# Altium schematic sheet Interface2.SchDoc
size A4
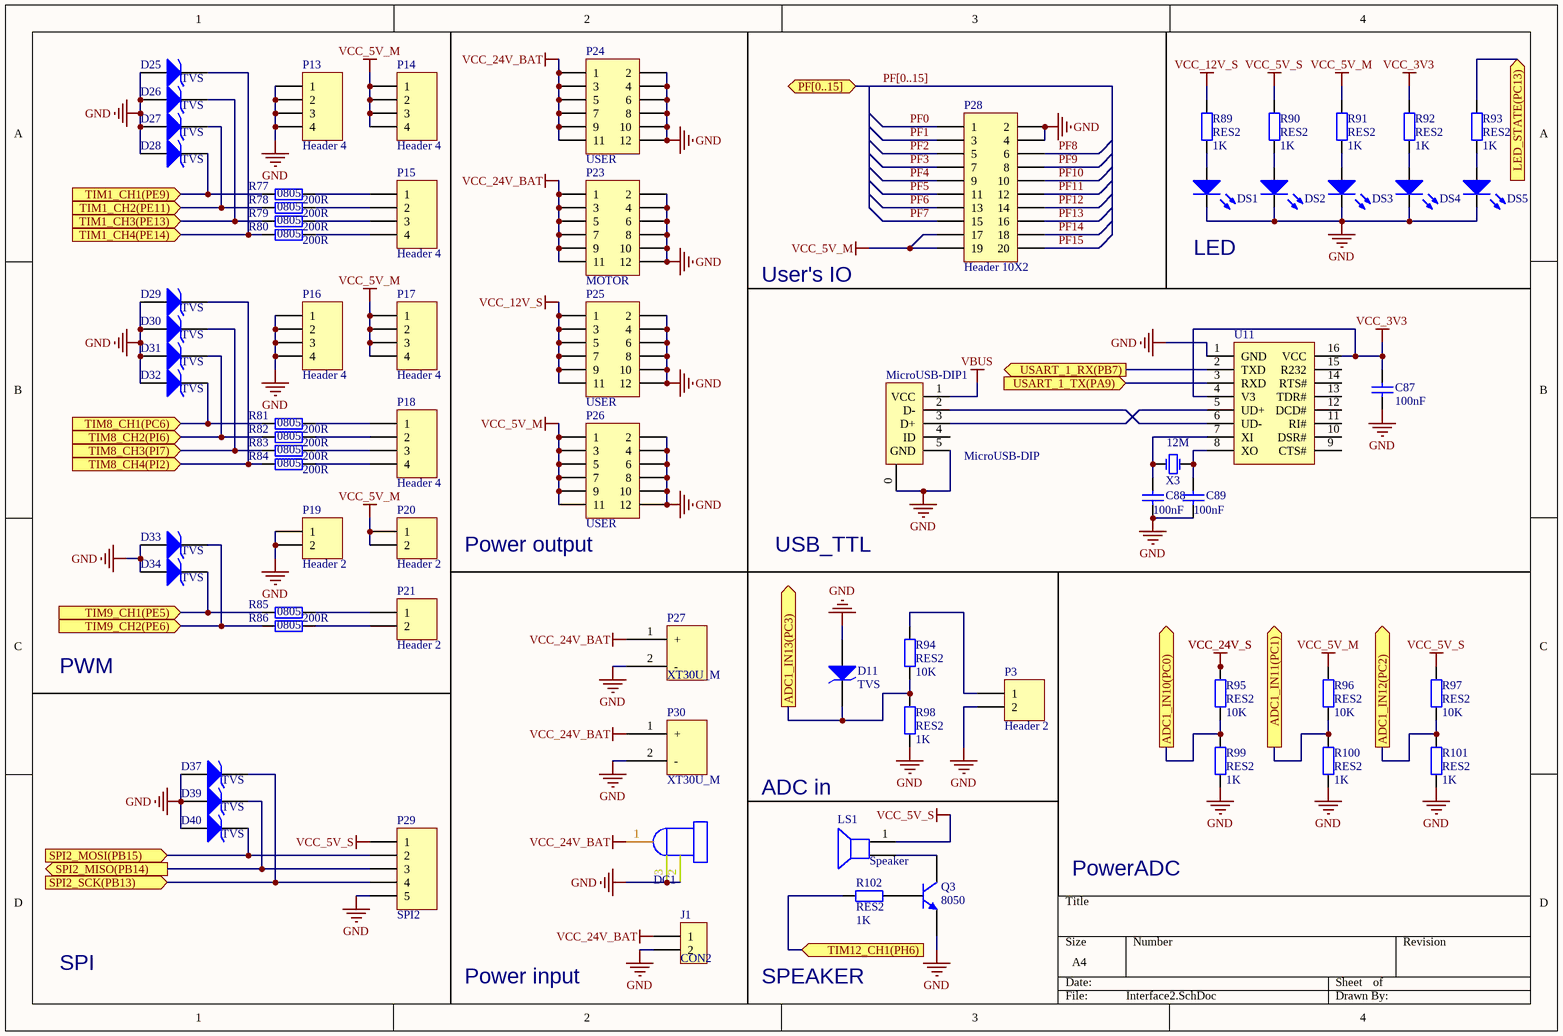
[diagram p0: Interface2.SchDoc]

## Parts
C87  value 100nF  [C 0805_L]  (hidden comment: CAP)
C88  value 100nF  [C 0805_L]  (hidden comment: CAP)
C89  value 100nF  [C 0805_L]  (hidden comment: CAP)
D11  TVS  [SOD-523]
D25  TVS  [SOD-523]
D26  TVS  [SOD-523]
D27  TVS  [SOD-523]
D28  TVS  [SOD-523]
D29  TVS  [SOD-523]
D30  TVS  [SOD-523]
D31  TVS  [SOD-523]
D32  TVS  [SOD-523]
D33  TVS  [SOD-523]
D34  TVS  [SOD-523]
D37  TVS  [SOD-523]
D39  TVS  [SOD-523]
D40  TVS  [SOD-523]
DC1  DC  [DC-005]  (value not drawn)
DS1  LED  [LED 0805B]  (value not drawn)
DS2  LED  [LED 0805B]  (value not drawn)
DS3  LED  [LED 0805B]  (value not drawn)
DS4  LED  [LED 0805B]  (value not drawn)
DS5  LED  [LED 0805B]  (value not drawn)
J1  CON2  [DG1282-5.0]
LS1  Speaker  [BEEP 5x9x5.5]
MicroUSB-DIP1  MicroUSB-DIP  [MICRO_USB_DIP]
P3  Header 2  [HDR2.54-LI-2P]
P13  Header 4  [HDR2.54-LI-4P]
P14  Header 4  [HDR2.54-LI-4P]
P15  Header 4  [HDR2.54-LI-4P]
P16  Header 4  [HDR2.54-LI-4P]
P17  Header 4  [HDR2.54-LI-4P]
P18  Header 4  [HDR2.54-LI-4P]
P19  Header 2  [HDR2.54-LI-2P]
P20  Header 2  [HDR2.54-LI-2P]
P21  Header 2  [HDR2.54-LI-2P]
P23  MOTOR  [HDR2.54-LI-2x6P]
P24  USER  [HDR2.54-LI-2x6P]
P25  USER  [HDR2.54-LI-2x6P]
P26  USER  [HDR2.54-LI-2x6P]
P27  XT30U_M  [XT30U-M]
P28  Header 10X2  [HDR10X2_A1]
P29  SPI2  [HDR2.54-LI-5P]
P30  XT30U_M  [XT30U-M]
Q3  8050  [SOT23-3L]
R77  0805  value 200R  [R 0805_L]
R78  0805  value 200R  [R 0805_L]
R79  0805  value 200R  [R 0805_L]
R80  0805  value 200R  [R 0805_L]
R81  0805  value 200R  [R 0805_L]
R82  0805  value 200R  [R 0805_L]
R83  0805  value 200R  [R 0805_L]
R84  0805  value 200R  [R 0805_L]
R85  0805  value 200R  [R 0805_L]
R86  0805  [R 0805_L]
R89  RES2  value 1K  [R 0805_L]
R90  RES2  value 1K  [R 0805_L]
R91  RES2  value 1K  [R 0805_L]
R92  RES2  value 1K  [R 0805_L]
R93  RES2  value 1K  [R 0805_L]
R94  RES2  value 10K  [R 0805_L]
R95  RES2  value 10K  [R 0805_L]
R96  RES2  value 10K  [R 0805_L]
R97  RES2  value 10K  [R 0805_L]
R98  RES2  value 1K  [R 0805_L]
R99  RES2  value 1K  [R 0805_L]
R100  RES2  value 1K  [R 0805_L]
R101  RES2  value 1K  [R 0805_L]
R102  RES2  value 1K  [R 0805_L]
U11  CH340G  [SOP16_M]  (value not drawn)
X3  12M  [OSC HC-49S]

## Ports
ADC1_IN10(PC0) (out), ADC1_IN11(PC1) (out), ADC1_IN12(PC2) (out), ADC1_IN13(PC3) (out), LED_STATE(PC13) (in), PF[0..15] (bidir), SPI2_MISO(PB14) (out), SPI2_MOSI(PB15) (in), SPI2_SCK(PB13) (in), TIM1_CH1(PE9) (in), TIM1_CH2(PE11) (in), TIM1_CH3(PE13) (in), TIM1_CH4(PE14) (in), TIM8_CH1(PC6) (in), TIM8_CH2(PI6) (in), TIM8_CH3(PI7) (in), TIM8_CH4(PI2) (in), TIM9_CH1(PE5) (in), TIM9_CH2(PE6) (in), TIM12_CH1(PH6) (in), USART_1_RX(PB7) (out), USART_1_TX(PA9) (in)

## Nets
GND: C87.1 C88.1 C89.1 D11.1(A) D25.1(A) D26.1(A) D27.1(A) D28.1(A) D29.1(A) D30.1(A) D31.1(A) D32.1(A) D33.1(A) D34.1(A) D37.1(A) D39.1(A) D40.1(A) DC1.2(-) DC1.3(-) DS1.2(K) DS2.2(K) DS3.2(K) DS4.2(K) DS5.2(K) J1.2 MicroUSB-DIP1.0 MicroUSB-DIP1.5(GND) P3.2 P13.1 P13.2 P13.3 P13.4 P16.1 P16.2 P16.3 P16.4 P19.1 P19.2 P23.2 P23.4 P23.6 P23.8 P23.10 P23.12 P24.2 P24.4 P24.6 P24.8 P24.10 P24.12 P25.2 P25.4 P25.6 P25.8 P25.10 P25.12 P26.2 P26.4 P26.6 P26.8 P26.10 P26.12 P27.2(-) P28.2 P28.4 P29.5 P30.2(-) Q3.2(E) R98.1 R99.1 R100.1 R101.1 U11.1(GND)
VBUS: MicroUSB-DIP1.1(VCC)
VCC_3V3: C87.2 R92.2 U11.4(V3) U11.16(VCC)
VCC_5V_M: P14.1 P14.2 P14.3 P14.4 P17.1 P17.2 P17.3 P17.4 P20.1 P20.2 P26.1 P26.3 P26.5 P26.7 P26.9 P26.11 P28.17 P28.19 R91.2 R96.2
VCC_5V_S: LS1.1 P29.1 R90.2 R97.2
VCC_12V_S: P25.1 P25.3 P25.5 P25.7 P25.9 P25.11 R89.2
VCC_24V_BAT: DC1.1(+) J1.1 P23.1 P23.3 P23.5 P23.7 P23.9 P23.11 P24.1 P24.3 P24.5 P24.7 P24.9 P24.11 P27.1(+) P30.1(+)
VCC_24V_S: R95.2
ADC1_IN10(PC0): R95.1 R99.2 ; port ADC1_IN10(PC0)
ADC1_IN11(PC1): R96.1 R100.2 ; port ADC1_IN11(PC1)
ADC1_IN12(PC2): R97.1 R101.2 ; port ADC1_IN12(PC2)
ADC1_IN13(PC3): D11.2(K) R94.1 R98.2 ; port ADC1_IN13(PC3)
LED_STATE(PC13): R93.2 ; port LED_STATE(PC13)
PF0: P28.1
PF1: P28.3
PF2: P28.5
PF3: P28.7
PF4: P28.9
PF5: P28.11
PF6: P28.13
PF7: P28.15
PF8: P28.6
PF9: P28.8
PF10: P28.10
PF11: P28.12
PF12: P28.14
PF13: P28.16
PF14: P28.18
PF15: P28.20
SPI2_MISO(PB14): D39.2(K) P29.3 ; port SPI2_MISO(PB14)
SPI2_MOSI(PB15): D40.2(K) P29.2 ; port SPI2_MOSI(PB15)
SPI2_SCK(PB13): D37.2(K) P29.4 ; port SPI2_SCK(PB13)
TIM1_CH1(PE9): D28.2(K) R77.1 ; port TIM1_CH1(PE9)
TIM1_CH2(PE11): D27.2(K) R78.1 ; port TIM1_CH2(PE11)
TIM1_CH3(PE13): D26.2(K) R79.1 ; port TIM1_CH3(PE13)
TIM1_CH4(PE14): D25.2(K) R80.1 ; port TIM1_CH4(PE14)
TIM8_CH1(PC6): D32.2(K) R81.1 ; port TIM8_CH1(PC6)
TIM8_CH2(PI6): D31.2(K) R82.1 ; port TIM8_CH2(PI6)
TIM8_CH3(PI7): D30.2(K) R83.1 ; port TIM8_CH3(PI7)
TIM8_CH4(PI2): D29.2(K) R84.1 ; port TIM8_CH4(PI2)
TIM9_CH1(PE5): D34.2(K) R85.1 ; port TIM9_CH1(PE5)
TIM9_CH2(PE6): D33.2(K) R86.1 ; port TIM9_CH2(PE6)
TIM12_CH1(PH6): R102.2 ; port TIM12_CH1(PH6)
USART_1_RX(PB7): U11.2(TXD) ; port USART_1_RX(PB7)
USART_1_TX(PA9): U11.3(RXD) ; port USART_1_TX(PA9)
NetC88_2: C88.2 U11.7(XI) X3.1(OSC1)
NetC89_2: C89.2 U11.8(XO) X3.2(OSC2)
NetDS1_1: DS1.1(A) R89.1
NetDS2_1: DS2.1(A) R90.1
NetDS3_1: DS3.1(A) R91.1
NetDS4_1: DS4.1(A) R92.1
NetDS5_1: DS5.1(A) R93.1
NetLS1_2: LS1.2 Q3.3(C)
NetMicroUSB-DIP1_2: MicroUSB-DIP1.2(D-) U11.6(UD-)
NetMicroUSB-DIP1_3: MicroUSB-DIP1.3(D+) U11.5(UD+)
NetP3_1: P3.1 R94.2
NetP15_1: P15.1 R77.2
NetP15_2: P15.2 R78.2
NetP15_3: P15.3 R79.2
NetP15_4: P15.4 R80.2
NetP18_1: P18.1 R81.2
NetP18_2: P18.2 R82.2
NetP18_3: P18.3 R83.2
NetP18_4: P18.4 R84.2
NetP21_1: P21.1 R85.2
NetP21_2: P21.2 R86.2
NetQ3_1: Q3.1(B) R102.1

Not connected (* = marked no-connect by the designer): MicroUSB-DIP1 4(ID); U11 9(CTS#) 10(DSR#) 11(RI#) 12(DCD#) 13(TDR#) 14(RTS#) 15(R232)

## Buses and harness runs
bus PF[0..15] = port PF[0..15]

## Notes on the sheet
- User's IO
- LED
- (near P26) Power output
- USB_TTL
- PWM
- ADC in
- PowerADC
- SPI
- Power input
- SPEAKER

## Library data of the parts
D11 D25-D34 D37 D39 D40 = D: High Conductance Fast Diode; Published: 8-Jun-2000; LatestRevisionDate: 17-Jul-2002; LatestRevisionNote: Re-released for DXP Platform.; DatasheetVersion: 1997; PackageReference: DO-35; Publisher: Altium Limited; PackageDescription: Diode, Axial; Body 3.8 x 1.9 mm (LxDia. max), Lead Dia. 0.53 mm (max); Code_JEDEC: DO-204-AH; ComponentLink1Description: Manufacturer Link; ComponentLink1URL: http://www.fairchildsemi.com/; ComponentLink2Description: Datasheet; ComponentLink2URL: http://www.fairchildsemi.com/ds/1N%2F1N4148.pdf
LS1 = Speaker: Loudspeaker; Published: 24-Mar-1999; LatestRevisionDate: 17-Jul-2002; LatestRevisionNote: Re-released for DXP Platform.; PackageReference: PIN2; Publisher: Altium Limited
P3 P19-P21 = Header 2: Header, 2-Pin; LatestRevisionDate: 17-Jul-2002; LatestRevisionNote: Re-released for DXP Platform.; Publisher: Altium Limited
P13-P18 = Header 4: Header, 4-Pin; LatestRevisionDate: 17-Jul-2002; LatestRevisionNote: Re-released for DXP Platform.; Publisher: Altium Limited
P23-P26 = Header 6X2: Header, 6-Pin, Dual row; LatestRevisionDate: 17-Jul-2002; LatestRevisionNote: Re-released for DXP Platform.; Publisher: Altium Limited
P28 = Header 10X2: Header, 10-Pin; LatestRevisionDate: 17-Jul-2002; LatestRevisionNote: Re-released for DXP Platform.; Publisher: Altium Limited
P29 = Header 5: Header, 5-Pin; LatestRevisionDate: 17-Jul-2002; LatestRevisionNote: Re-released for DXP Platform.; Publisher: Altium Limited
Q3 = NPN  SOT: NPN Bipolar Transistor; Published: 8-Jun-2000; LatestRevisionDate: 17-Jul-2002; LatestRevisionNote: Re-released for DXP Platform.; PackageReference: TO-226-AA; Publisher: Altium Limited; PackageDescription: TO, Flat Index; 3 In-Line, Axial Leads; Body Dia. 4.8mm; Leads 0.55 x 0.51 mm (max); Code_JEDEC: TO-226-AA
R77-R86 R89-R102 = RES2: Resistor; Published: 8-Jun-2000; LatestRevisionDate: 17-Jul-2002; LatestRevisionNote: Re-released for DXP Platform.; PackageReference: AXIAL-0.3; Publisher: Altium Limited; PackageDescription: Axial Device, Thru-Hole; 2 Leads; 0.3 in Pin Spacing
X3 = YX